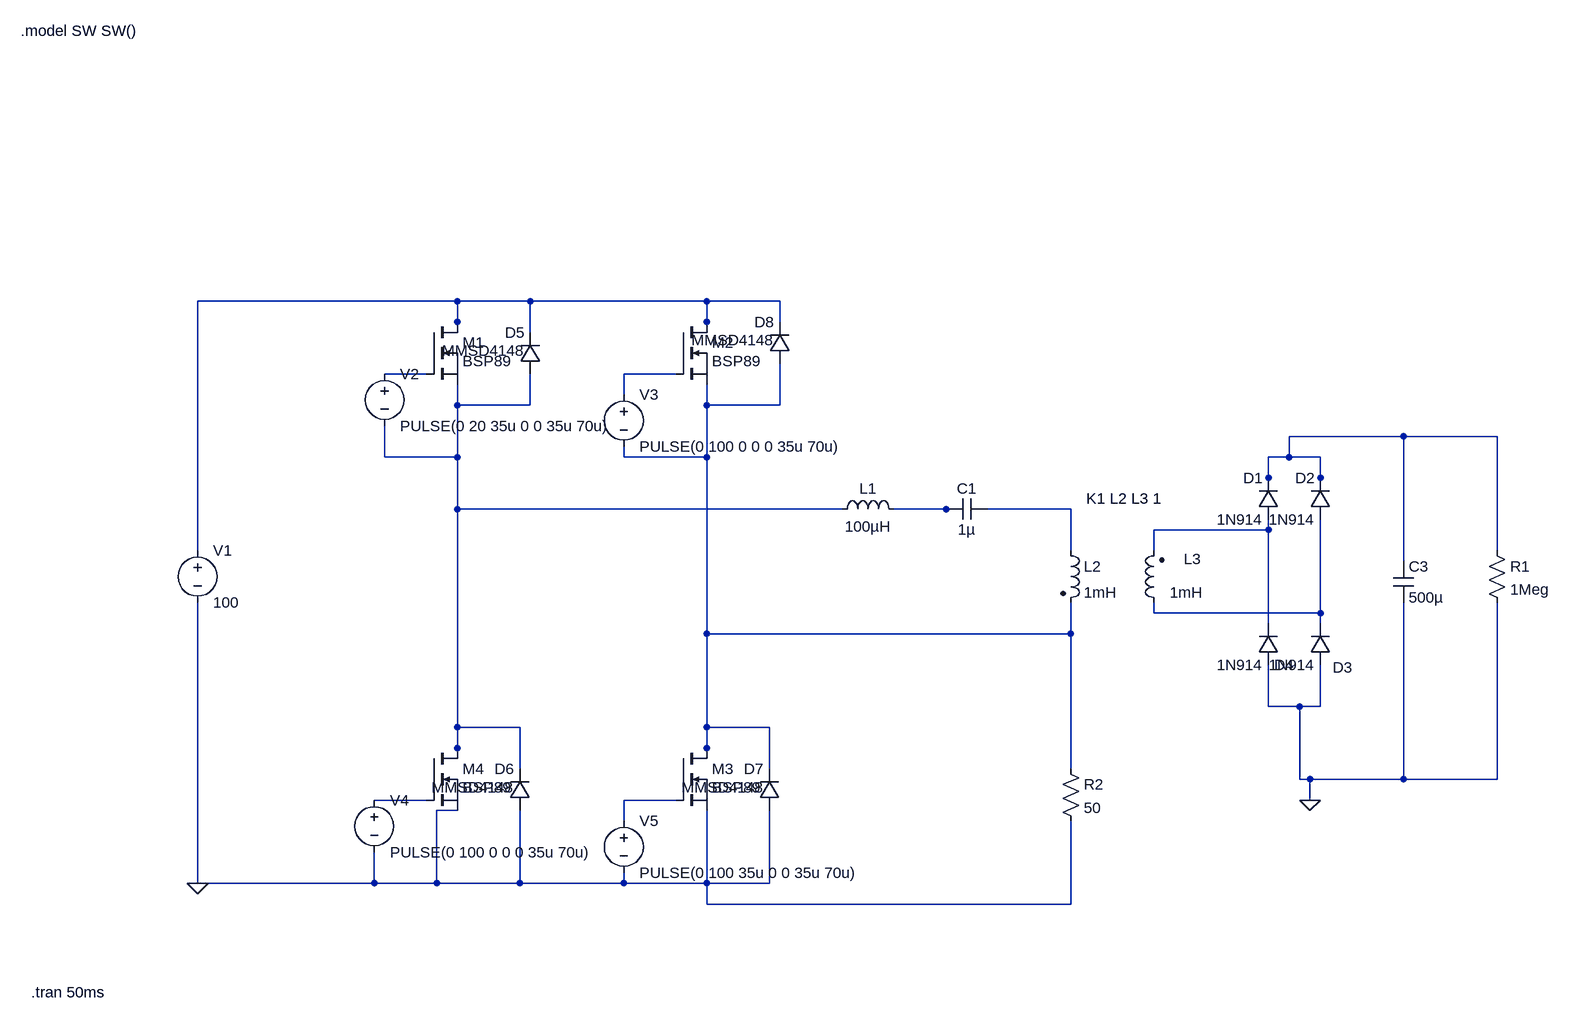
[diagram p0: schematic test.asc]
test.asc, the LTspice schematic file:
Version 4
SHEET 1 880 1848
WIRE -2096 768 -2496 768
WIRE -1984 768 -2096 768
WIRE -1712 768 -1984 768
WIRE -1600 768 -1712 768
WIRE -2096 800 -2096 768
WIRE -1712 800 -1712 768
WIRE -1600 800 -1600 768
WIRE -2096 816 -2096 800
WIRE -1984 816 -1984 768
WIRE -1712 816 -1712 800
WIRE -2144 880 -2208 880
WIRE -1760 880 -1840 880
WIRE -1840 912 -1840 880
WIRE -2096 928 -2096 896
WIRE -1984 928 -1984 880
WIRE -1984 928 -2096 928
WIRE -1712 928 -1712 896
WIRE -1600 928 -1600 864
WIRE -1600 928 -1712 928
WIRE -640 976 -816 976
WIRE -496 976 -640 976
WIRE -2208 1008 -2208 960
WIRE -2096 1008 -2096 928
WIRE -2096 1008 -2208 1008
WIRE -1840 1008 -1840 992
WIRE -1712 1008 -1712 928
WIRE -1712 1008 -1840 1008
WIRE -816 1008 -816 976
WIRE -816 1008 -848 1008
WIRE -768 1008 -816 1008
WIRE -848 1040 -848 1008
WIRE -768 1040 -768 1008
WIRE -848 1056 -848 1040
WIRE -768 1056 -768 1040
WIRE -2096 1088 -2096 1008
WIRE -1504 1088 -2096 1088
WIRE -1344 1088 -1424 1088
WIRE -1328 1088 -1344 1088
WIRE -1152 1088 -1280 1088
WIRE -848 1120 -848 1104
WIRE -848 1120 -1024 1120
WIRE -2496 1152 -2496 768
WIRE -1152 1152 -1152 1088
WIRE -1024 1152 -1024 1120
WIRE -496 1152 -496 976
WIRE -640 1168 -640 976
WIRE -1024 1248 -1024 1232
WIRE -768 1248 -768 1104
WIRE -768 1248 -1024 1248
WIRE -848 1264 -848 1120
WIRE -768 1264 -768 1248
WIRE -1712 1280 -1712 1008
WIRE -1152 1280 -1152 1232
WIRE -1152 1280 -1712 1280
WIRE -848 1392 -848 1328
WIRE -800 1392 -848 1392
WIRE -768 1392 -768 1328
WIRE -768 1392 -800 1392
WIRE -2096 1424 -2096 1088
WIRE -2000 1424 -2096 1424
WIRE -1712 1424 -1712 1280
WIRE -1616 1424 -1712 1424
WIRE -2096 1456 -2096 1424
WIRE -1712 1456 -1712 1424
WIRE -2096 1472 -2096 1456
WIRE -1712 1472 -1712 1456
WIRE -2000 1488 -2000 1424
WIRE -1616 1488 -1616 1424
WIRE -1152 1488 -1152 1280
WIRE -800 1504 -800 1392
WIRE -784 1504 -800 1504
WIRE -640 1504 -640 1232
WIRE -640 1504 -784 1504
WIRE -496 1504 -496 1232
WIRE -496 1504 -640 1504
WIRE -2144 1536 -2224 1536
WIRE -1760 1536 -1840 1536
WIRE -784 1536 -784 1504
WIRE -2096 1552 -2128 1552
WIRE -1840 1568 -1840 1536
WIRE -2496 1664 -2496 1232
WIRE -2224 1664 -2224 1616
WIRE -2224 1664 -2496 1664
WIRE -2128 1664 -2128 1552
WIRE -2128 1664 -2224 1664
WIRE -2000 1664 -2000 1552
WIRE -2000 1664 -2128 1664
WIRE -1840 1664 -1840 1648
WIRE -1840 1664 -2000 1664
WIRE -1712 1664 -1712 1552
WIRE -1712 1664 -1840 1664
WIRE -1616 1664 -1616 1552
WIRE -1616 1664 -1712 1664
WIRE -1712 1696 -1712 1664
WIRE -1152 1696 -1152 1568
WIRE -1152 1696 -1712 1696
FLAG -784 1536 0
FLAG -2496 1664 0
SYMBOL diode -832 1104 R180
WINDOW 0 24 64 Left 2
WINDOW 3 24 0 Left 2
SYMATTR InstName D1
SYMATTR Value 1N914
SYMBOL diode -752 1104 R180
WINDOW 0 24 64 Left 2
WINDOW 3 24 0 Left 2
SYMATTR InstName D2
SYMATTR Value 1N914
SYMBOL diode -752 1328 R180
WINDOW 0 -34 -4 Left 2
WINDOW 3 24 0 Left 2
SYMATTR InstName D3
SYMATTR Value 1N914
SYMBOL diode -832 1328 R180
WINDOW 0 -24 0 Left 2
WINDOW 3 24 0 Left 2
SYMATTR InstName D4
SYMATTR Value 1N914
SYMBOL ind2 -1008 1248 R180
WINDOW 0 -57 83 Left 2
WINDOW 3 -59 32 Left 2
SYMATTR InstName L3
SYMATTR Value 1mH
SYMATTR Type ind
SYMBOL voltage -2496 1136 R0
WINDOW 123 0 0 Left 2
WINDOW 39 24 124 Left 2
SYMATTR InstName V1
SYMATTR Value 100
SYMBOL diode -1968 880 R180
WINDOW 0 24 64 Left 2
WINDOW 3 24 36 Left 2
SYMATTR InstName D5
SYMATTR Value MMSD4148
SYMBOL diode -1984 1552 R180
WINDOW 0 24 64 Left 2
WINDOW 3 24 36 Left 2
SYMATTR InstName D6
SYMATTR Value MMSD4148
SYMBOL diode -1600 1552 R180
WINDOW 0 24 64 Left 2
WINDOW 3 24 36 Left 2
SYMATTR InstName D7
SYMATTR Value MMSD4148
SYMBOL diode -1584 864 R180
WINDOW 0 24 64 Left 2
WINDOW 3 24 36 Left 2
SYMATTR InstName D8
SYMATTR Value MMSD4148
SYMBOL cap -656 1168 R0
SYMATTR InstName C3
SYMATTR Value 500µ
SYMBOL nmos -2144 800 R0
WINDOW 3 56 60 Left 2
SYMATTR Value BSP89
SYMATTR InstName M1
SYMBOL nmos -1760 800 R0
WINDOW 3 56 60 Left 2
SYMATTR Value BSP89
SYMATTR InstName M2
SYMBOL nmos -1760 1456 R0
WINDOW 3 56 60 Left 2
SYMATTR Value BSP89
SYMATTR InstName M3
SYMBOL nmos -2144 1456 R0
WINDOW 3 56 60 Left 2
SYMATTR Value BSP89
SYMATTR InstName M4
SYMBOL voltage -2208 864 R0
WINDOW 123 0 0 Left 2
WINDOW 39 0 0 Left 2
SYMATTR InstName V2
SYMATTR Value PULSE(0 20 35u 0 0 35u 70u)
SYMBOL voltage -1840 896 R0
WINDOW 123 0 0 Left 2
WINDOW 39 0 0 Left 2
SYMATTR InstName V3
SYMATTR Value PULSE(0 100 0 0 0 35u 70u)
SYMBOL voltage -2224 1520 R0
WINDOW 123 0 0 Left 2
WINDOW 39 0 0 Left 2
SYMATTR InstName V4
SYMATTR Value PULSE(0 100 0 0 0 35u 70u)
SYMBOL voltage -1840 1552 R0
WINDOW 123 0 0 Left 2
WINDOW 39 0 0 Left 2
SYMATTR InstName V5
SYMATTR Value PULSE(0 100 35u 0 0 35u 70u)
SYMBOL res -512 1136 R0
SYMATTR InstName R1
SYMATTR Value 1Meg
SYMBOL ind -1520 1104 R270
WINDOW 0 32 56 VTop 2
WINDOW 3 5 56 VBottom 2
SYMATTR InstName L1
SYMATTR Value 100µH
SYMBOL cap -1280 1072 R90
WINDOW 0 0 32 VBottom 2
WINDOW 3 32 32 VTop 2
SYMATTR InstName C1
SYMATTR Value 1µ
SYMBOL ind2 -1168 1136 R0
SYMATTR InstName L2
SYMATTR Value 1mH
SYMATTR Type ind
SYMBOL res -1168 1472 R0
SYMATTR InstName R2
SYMATTR Value 50
TEXT -2752 1832 Left 2 !.tran 50ms
TEXT -2768 352 Left 2 !.model SW SW()
TEXT -1128 1072 Left 2 !K1 L2 L3 1

The netlist it stands for:
* test.asc
D1 N009 N006 1N914
D2 N010 N006 1N914
D3 0 N010 1N914
D4 0 N009 1N914
L3 N010 N009 1mH
V1 N001 0 100
D5 N004 N001 MMSD4148
D6 0 N004 MMSD4148
D7 0 N005 MMSD4148
D8 N005 N001 MMSD4148
C3 N006 0 500µ
M1 N001 N002 N004 N004 BSP89
M2 N001 N003 N005 N005 BSP89
M3 N005 N012 0 0 BSP89
M4 N004 N011 0 0 BSP89
V2 N002 N004 PULSE(0 20 35u 0 0 35u 70u)
V3 N003 N005 PULSE(0 100 0 0 0 35u 70u)
V4 N011 0 PULSE(0 100 0 0 0 35u 70u)
V5 N012 0 PULSE(0 100 35u 0 0 35u 70u)
R1 N006 0 1Meg
L1 N004 N007 100µH
C1 N008 N007 1µ
L2 N008 N005 1mH
R2 N005 0 50
.model D D
.lib standard.dio
.model NMOS NMOS
.model PMOS PMOS
.lib standard.mos
.tran 50ms
.model SW SW()
K1 L2 L3 1
.backanno
.end